# EAGLE design SolenoidController (EAGLE 9.4.1)
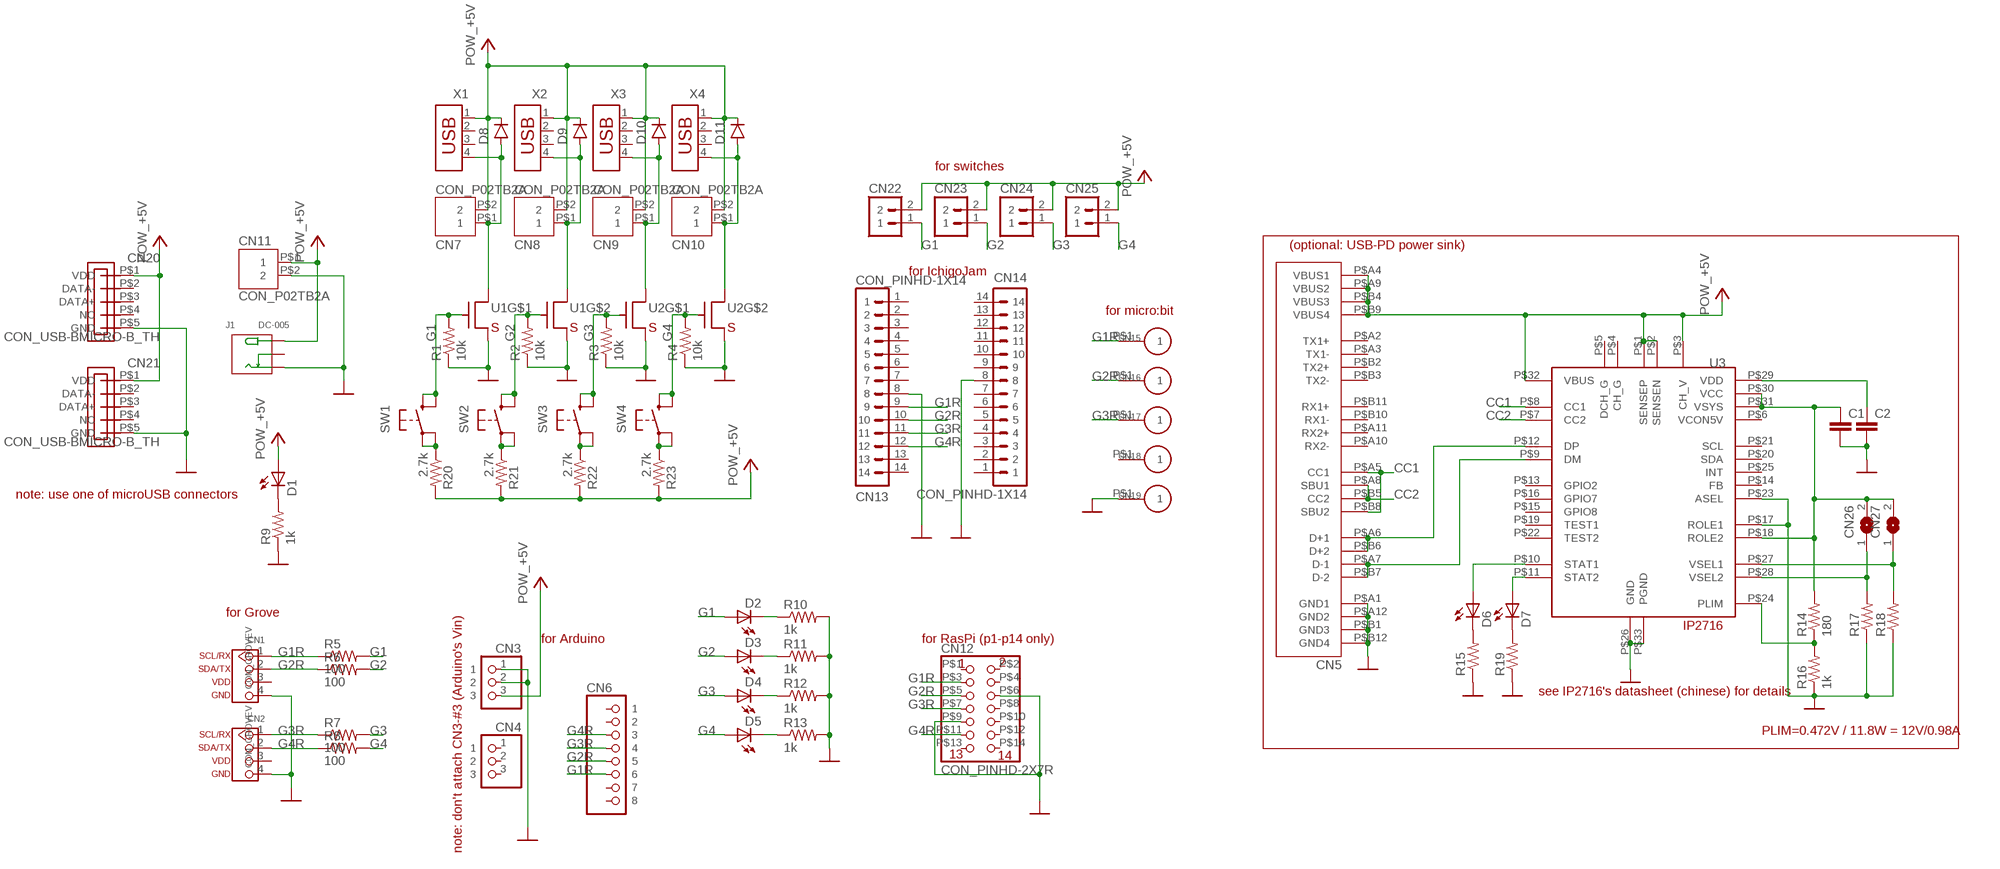
[diagram p0: schematic, sheet 1]

## Parts
C1  CAP0603  [0603]
C2  CAP0603  [0603]
CN1  CON_GROVEV  [CON_GROVE_V]
CN2  CON_GROVEV  [CON_GROVE_V]
CN3  CON_PINHD-1X3R  [1X03R]
CN4  CON_PINHD-1X3R  [1X03R]
CN5  CON_USB-C  [USB-C_24P]
CN6  CON_PINHD-1X8R  [1X08R]
CN7  CON_P02TB2A  [TERM_BLOCK_2P]
CN8  CON_P02TB2A  [TERM_BLOCK_2P]
CN9  CON_P02TB2A  [TERM_BLOCK_2P]
CN10  CON_P02TB2A  [TERM_BLOCK_2P]
CN11  CON_P02TB2A  [TERM_BLOCK_2P]
CN12  CON_PINHD-2X7R  [2X7R]
CN13  CON_PINHD-1X14  [1X14]
CN14  CON_PINHD-1X14  [1X14]
CN15  CON_P01TH04MM  [TH4MM]
CN16  CON_P01TH04MM  [TH4MM]
CN17  CON_P01TH04MM  [TH4MM]
CN18  CON_P01TH04MM  [TH4MM]
CN19  CON_P01TH04MM  [TH4MM]
CN20  CON_USB-BMICRO-B_TH  [USB-MICROB-TH]
CN21  CON_USB-BMICRO-B_TH  [USB-MICROB-TH]
CN22  CON_PINHD-1X2PTH  [SPARKFUN_1X02]
CN23  CON_PINHD-1X2PTH  [SPARKFUN_1X02]
CN24  CON_PINHD-1X2PTH  [SPARKFUN_1X02]
CN25  CON_PINHD-1X2PTH  [SPARKFUN_1X02]
CN26  JUMPER_SJ  [JUMPER_SJ]
CN27  JUMPER_SJ  [JUMPER_SJ]
D1  LED5MM  [SPARKFUN_LED5MM]
D2  LED5MM  [SPARKFUN_LED5MM]
D3  LED5MM  [SPARKFUN_LED5MM]
D4  LED5MM  [SPARKFUN_LED5MM]
D5  LED5MM  [SPARKFUN_LED5MM]
D6  LED0603  [SPARKFUN_LED-0603]
D7  LED0603  [SPARKFUN_LED-0603]
D8  DIODESOD123FL  [SOD123FL]
D9  DIODESOD123FL  [SOD123FL]
D10  DIODESOD123FL  [SOD123FL]
D11  DIODESOD123FL  [SOD123FL]
J1  DC-005  CONN-POWER-JACK-2.1MM(DC-005)  [DCJ3P-14.2X11.0X9.0MM]
R1  10k  RES0603  [0603]
R2  10k  RES0603  [0603]
R3  10k  RES0603  [0603]
R4  10k  RES0603  [0603]
R5  100  RES0603  [0603]
R6  100  RES0603  [0603]
R7  100  RES0603  [0603]
R8  100  RES0603  [0603]
R9  1k  RES0603  [0603]
R10  1k  RES0603  [0603]
R11  1k  RES0603  [0603]
R12  1k  RES0603  [0603]
R13  1k  RES0603  [0603]
R14  180  RES0603  [0603]
R15  RES0603  [0603]
R16  1k  RES0603  [0603]
R17  RES0603  [0603]
R18  RES0603  [0603]
R19  RES0603  [0603]
R20  2.7k  RES0603  [0603]
R21  2.7k  RES0603  [0603]
R22  2.7k  RES0603  [0603]
R23  2.7k  RES0603  [0603]
SW1  SW_TACTSMD_B3FS4  [SW_B3FS-4]
SW2  SW_TACTSMD_B3FS4  [SW_B3FS-4]
SW3  SW_TACTSMD_B3FS4  [SW_B3FS-4]
SW4  SW_TACTSMD_B3FS4  [SW_B3FS-4]
U1  TR_NMOS_IRF7103  [SO08]
U2  TR_NMOS_IRF7103  [SO08]
U3  PMU_IP2716  [QFN32E]
X1  CON_USB-A  [USB-A]
X2  CON_USB-A  [USB-A]
X3  CON_USB-A  [USB-A]
X4  CON_USB-A  [USB-A]

## Nets
+5V: CN3.3 CN5.P$A4(VBUS1) CN5.P$A9(VBUS2) CN5.P$B4(VBUS3) CN5.P$B9(VBUS4) CN7.P$2 CN8.P$2 CN9.P$2 CN10.P$2 CN11.P$1 CN20.P$1(VDD) CN21.P$1(VDD) CN22.2 CN23.2 CN24.2 CN25.2 D1.A D8.P$K D9.P$K D10.P$K D11.P$K J1.+ R20.2 R21.2 R22.2 R23.2 U3.P$1(SENSEP) U3.P$2(SENSEN) U3.P$3(CH_V) U3.P$32(VBUS) X1.1 X2.1 X3.1 X4.1 ; supply symbol labelled POW_+5V
CC1: CN5.P$A5(CC1) CN5.P$B8(SBU2) U3.P$8(CC1)
CC2: CN5.P$A8(SBU1) CN5.P$B5(CC2) U3.P$7(CC2)
G1: CN22.1 D2.A R1.2 R5.2 SW1.P$3(S) SW1.P$4(S1) U1.2(G)
G1R: CN1.1 CN6.6 CN12.P$3 CN13.9 CN15.P$1 R5.1
G2: CN23.1 D3.A R2.2 R6.2 SW2.P$3(S) SW2.P$4(S1) U1.4(G)
G2R: CN1.2 CN6.5 CN12.P$5 CN13.10 CN16.P$1 R6.1
G3: CN24.1 D4.A R3.2 R7.2 SW3.P$3(S) SW3.P$4(S1) U2.2(G)
G3R: CN2.1 CN6.4 CN12.P$7 CN13.11 CN17.P$1 R7.1
G4: CN25.1 D5.A R4.2 R8.2 SW4.P$3(S) SW4.P$4(S1) U2.4(G)
G4R: CN2.2 CN6.3 CN12.P$11 CN13.12 R8.1
GND: C1.2 C2.2 CN1.4 CN2.4 CN3.1 CN3.2 CN5.P$A1(GND1) CN5.P$A12(GND2) CN5.P$B1(GND3) CN5.P$B12(GND4) CN11.P$2 CN12.P$6 CN12.P$9 CN13.8 CN14.8 CN19.P$1 CN20.P$5(GND) CN21.P$5(GND) J1.-1(-) R1.1 R2.1 R3.1 R4.1 R9.1 R10.2 R11.2 R12.2 R13.2 R15.1 R16.1 R17.1 R18.1 R19.1 U1.1(S) U1.3(S) U2.1(S) U2.3(S) U3.P$17(ROLE1) U3.P$23(ASEL) U3.P$26(GND) U3.P$33(PGND) ; supply symbol labelled POW_GND
N$1: CN7.P$1 D8.P$A U1.7(D) X1.4
N$2: CN8.P$1 D9.P$A U1.5(D) X2.4
N$3: CN9.P$1 D10.P$A U2.7(D) X3.4
N$4: C2.1 U3.P$29(VDD)
N$5: D1.K(C) R9.2
N$6: D2.K(C) R10.1
N$7: R14.1 R16.2 U3.P$24(PLIM)
N$8: D3.K(C) R11.1
N$9: CN26.1 R17.2 U3.P$28(VSEL2)
N$10: D4.K(C) R12.1
N$11: R21.1 SW2.P$1(P) SW2.P$2(P1)
N$12: D5.K(C) R13.1
N$13: CN27.1 R18.2 U3.P$27(VSEL1)
N$14: C1.1 CN26.2 CN27.2 R14.2 U3.P$18(ROLE2) U3.P$30(VCC) U3.P$31(VSYS)
N$15: D6.C R15.2
N$16: CN10.P$1 D11.P$A U2.5(D) X4.4
N$17: D7.C R19.2
N$18: D7.A U3.P$11(STAT2)
N$19: D6.A U3.P$10(STAT1)
N$20: CN5.P$A6(D+1) CN5.P$B6(D+2) U3.P$12(DP)
N$21: R23.1 SW4.P$1(P) SW4.P$2(P1)
N$22: CN5.P$A7(D-1) CN5.P$B7(D-2) U3.P$9(DM)
N$23: R22.1 SW3.P$1(P) SW3.P$2(P1)
N$24: R20.1 SW1.P$1(P) SW1.P$2(P1)
Unconnected: CN1.3 CN2.3 CN4.1 CN4.2 CN4.3 CN5.P$A2(TX1+) CN5.P$A3(TX1-) CN5.P$A10(RX2-) CN5.P$A11(RX2+) CN5.P$B2(TX2+) CN5.P$B3(TX2-) CN5.P$B10(RX1-) CN5.P$B11(RX1+) CN6.1 CN6.2 CN6.7 CN6.8 CN12.P$1 CN12.P$2 CN12.P$4 CN12.P$8 CN12.P$10 CN12.P$12 CN12.P$13 CN12.P$14 CN13.1 CN13.2 CN13.3 CN13.4 CN13.5 CN13.6 CN13.7 CN13.13 CN13.14 CN14.1 CN14.2 CN14.3 CN14.4 CN14.5 CN14.6 CN14.7 CN14.9 CN14.10 CN14.11 CN14.12 CN14.13 CN14.14 CN18.P$1 CN20.P$2(DATA-) CN20.P$3(DATA+) CN20.P$4(NC) CN21.P$2(DATA-) CN21.P$3(DATA+) CN21.P$4(NC) J1.-2(CDN) U3.P$4(CH_G) U3.P$5(DCH_G) U3.P$6(VCON5V) U3.P$13(GPIO2) U3.P$14(FB) U3.P$15(GPIO8) U3.P$16(GPIO7) U3.P$19(TEST1) U3.P$20(SDA) U3.P$21(SCL) U3.P$22(TEST2) U3.P$25(INT) X1.2 X1.3 X2.2 X2.3 X3.2 X3.3 X4.2 X4.3

## Notes on the sheet
- for switches
- (optional: USB-PD power sink)
- for IchigoJam
- for micro:bit
- note: use one of microUSB connectors
- for Grove
- IP2716
- for Arduino | for RasPi (p1-p14 only)
- see IP2716's datasheet (chinese) for details
- PLIM=0.472V / 11.8W = 12V/0.98A
- note: don't attach CN3-#3 (Arduino's Vin)

## Library data of the parts
C1 C2 = akita:CAP: Capacitor Standard 0603 ceramic capacitor, and 0.1" leaded capacitor.
CN1 CN2 = akita:CON_GROVE: Seeed Grove
CN3 CN4 = akita:CON_PINHD-1X3: PIN HEADER
CN5 = akita:CON_USB-C: USB Type-C, Receptable
CN6 = akita:CON_PINHD-1X8: PIN HEADER
CN7-CN11 = akita:CON_P02: general 2p connector
CN12 = akita:CON_PINHD-2X7
CN13 CN14 = akita:CON_PINHD-1X14
CN15-CN19 = akita:CON_P01
CN20 CN21 = akita:CON_USB-B
CN22-CN25 = akita:CON_PINHD-1X2: Header 2 Standard 2-pin 0.1" header. Use with straight break away headers (SKU : PRT-00116), right angle break away headers (PRT-00553), swiss pins (PRT-00743), machine pins (PRT-00117), and female headers (PRT-00115). Molex polarized connector foot print use with SKU : PRT-08233 with associated crimp pins and housings.
CN26 CN27 = akita:JUMPER_SJ: SMD solder JUMPER
D1-D7 = akita:LED: LEDs Standard schematic elements and footprints for 5mm, 3mm, 1206, and 0603 sized LEDs. 5mm - Spark Fun Electronics SKU : COM-00529 (and others)
D8-D11 = akita:DIODE: Diode
J1 = Seeed-Connector:CONN-POWER-JACK-2.1MM(DC-005): 320120003; MPN: DC-005
R1-R23 = akita:RES: Resistor Basic schematic elements and footprints for 0603, 1206, and PTH resistors.
SW1-SW4 = akita:SW_TACT: OMRON SWITCH
U1 U2 = akita:TR_NMOS_IRF7103: Dual nMOS, SOP8, IOR IRF7103, Fairchild NDS9936
U3 = akita:PMU_IP2716: Injoinic, USB-C PD, DFP/UFP
X1-X4 = akita:CON_USB-A: AMP connector

## Board
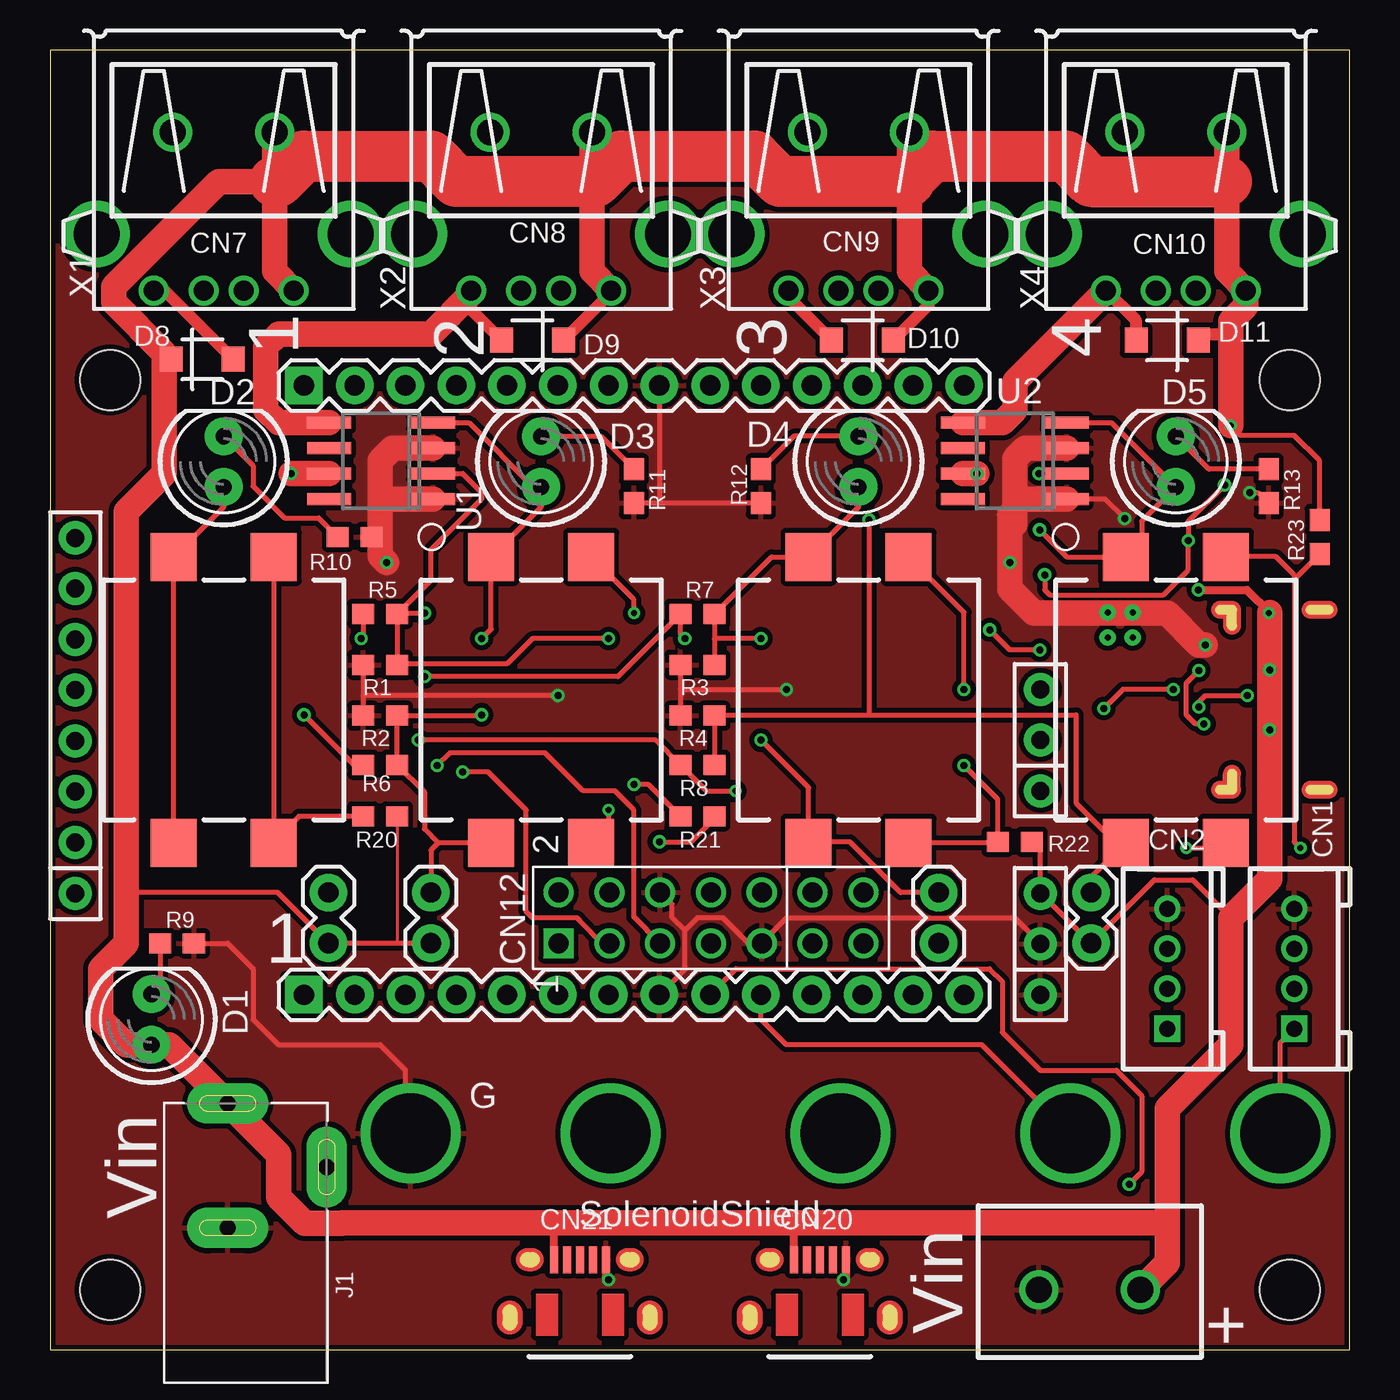
[diagram p1: board, top side]
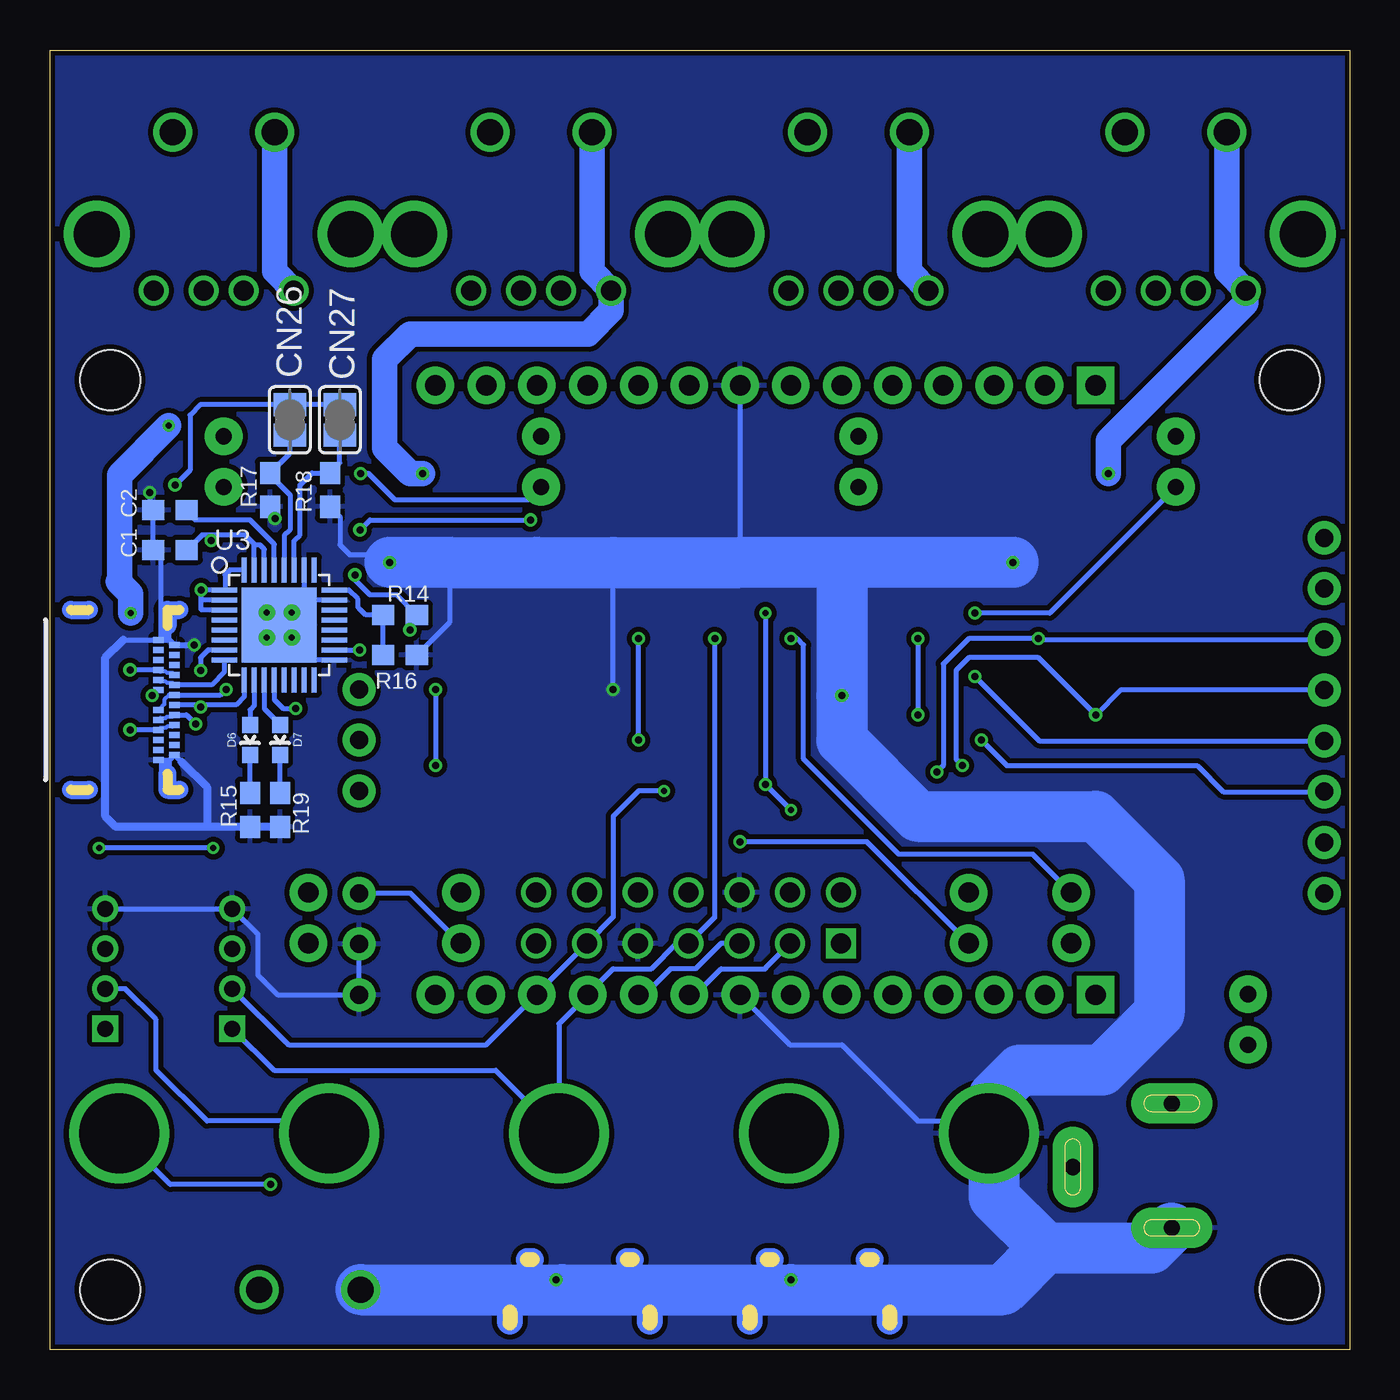
[diagram p2: board, bottom side, seen from below]

Size 65 x 65 mm. Coordinates in mm from the lower left corner, seen from the top.
Outline: 0,0 65,0 65,65 0,65 0,0
Copper layers (1*16): Top 0.035mm / dielectric 1.5mm / Bottom 0.035mm
Design rules "SeeedStudio_2layer_DRU_no_angle_20140221": minimum track width 6mil, minimum drill 12mil, track to track 6mil, track to pad 6mil, pad to pad 6mil, via to via 6mil, smd to smd 0mil, copper to edge 10mil, drill to drill 10mil, minimum pad ring 10mil, minimum via ring 6mil, stop-mask expansion 2mil, vias tented up to drill 100mil, thermal gap 10mil
Holes 3 mm at 3,48.5 3,3 62,48.5 62,3

### Footprints (pad centres in the part's own frame; a part is rotated, then mirrored left to right if it is on the bottom)
0603 = smd 1.1 x 1: 1 -0.85,0; 2 0.85,0
CON_GROVE_V = drill 0.8 pad 1.27 square: 1 -3,0 | drill 0.8 pad 1.27: 2 -1,0; 3 1,0; 4 3,0
1X03R = drill 0.9 pad 1.651: 1 -2.54,0; 2 0,0; 3 2.54,0
USB-C_24P = smd 0.3 x 0.53: P$A1 -2.75,2.73; P$A2 -2.25,2.73; P$A3 -1.75,2.73; P$A4 -1.25,2.73; P$A5 -0.75,2.73; P$A6 -0.25,2.73; P$A7 0.25,2.73; P$A8 0.75,2.73; P$A9 1.25,2.73; P$A10 1.75,2.73; P$A11 2.25,2.73; P$A12 2.75,2.73; P$B1 3,1.93; P$B2 2.5,1.93; P$B3 2,1.93; P$B4 1.5,1.93; P$B5 1,1.93; P$B6 0.5,1.93; P$B7 -0.5,1.93; P$B8 -1,1.93; P$B9 -1.5,1.93; P$B10 -2,1.93; P$B11 -2.5,1.93; P$B12 -3,1.93
1X08R = drill 0.9 pad 1.651: 1 -8.89,0; 2 -6.35,0; 3 -3.81,0; 4 -1.27,0; 5 1.27,0; 6 3.81,0; 7 6.35,0; 8 8.89,0
TERM_BLOCK_2P = drill 1.3: P$1 2.54,0; P$2 -2.54,0
2X7R = drill 1 square: P$1 -7.62,-1.27 | drill 1: P$2 -7.62,1.27; P$3 -5.08,-1.27; P$4 -5.08,1.27; P$5 -2.54,-1.27; P$6 -2.54,1.27; P$7 0,-1.27; P$8 0,1.27; P$9 2.54,-1.27; P$10 2.54,1.27; P$11 5.08,-1.27; P$12 5.08,1.27; P$13 7.62,-1.27; P$14 7.62,1.27
1X14 = drill 1.016 pad 1.88 square: 1 -16.51,0 | drill 1.016 pad 1.88: 2 -13.97,0; 3 -11.43,0; 4 -8.89,0; 5 -6.35,0; 6 -3.81,0; 7 -1.27,0; 8 1.27,0; 9 3.81,0; 10 6.35,0; 11 8.89,0; 12 11.43,0; 13 13.97,0; 14 16.51,0
TH4MM = drill 4: P$1 0,0
USB-MICROB-TH = smd 0.4 x 1.35: P$1 -1.3,1.5; P$2 -0.65,1.5; P$3 0,1.5; P$4 0.65,1.5; P$5 1.3,1.5
SPARKFUN_1X02 = drill 1.016 pad 1.88: 1 0,0; 2 2.54,0
JUMPER_SJ = smd 1.168 x 1.6: 1 -0.762,0; 2 0.762,0
SPARKFUN_LED5MM = drill 0.813 pad 1.88: A -1.27,0; K 1.27,0
SPARKFUN_LED-0603 = smd 0.8 x 0.8: A 0,-0.75; C 0,0.75
SOD123FL = smd 1.15 x 1.25: P$A -1.55,0; P$K 1.55,0
DCJ3P-14.2X11.0X9.0MM = drill 0.813 pad 2.032 long: + 3.175,0; -1 -3.048,0; -2 0,-4.953
SW_B3FS-4 = smd 2.4 x 2.3: P$1 7.15,-2.5; P$2 -7.15,-2.5; P$3 7.15,2.5; P$4 -7.15,2.5
SO08 = smd 0.6 x 2.2: 1 -1.905,-2.6; 2 -0.635,-2.6; 3 0.635,-2.6; 4 1.905,-2.6; 5 1.905,2.6; 6 0.635,2.6; 7 -0.635,2.6; 8 -1.905,2.6
QFN32E = smd 1.27 x 0.25: P$1 -2.75,1.75; P$2 -2.75,1.25; P$3 -2.75,0.75; P$4 -2.75,0.25; P$5 -2.75,-0.25; P$6 -2.75,-0.75; P$7 -2.75,-1.25; P$8 -2.75,-1.75; P$17 2.75,-1.75; P$18 2.75,-1.25; P$19 2.75,-0.75; P$20 2.75,-0.25; P$21 2.75,0.25; P$22 2.75,0.75; P$23 2.75,1.25; P$24 2.75,1.75 | smd 0.25 x 1.27: P$9 -1.75,-2.75; P$10 -1.25,-2.75; P$11 -0.75,-2.75; P$12 -0.25,-2.75; P$13 0.25,-2.75; P$14 0.75,-2.75; P$15 1.25,-2.75; P$16 1.75,-2.75; P$25 1.75,2.75; P$26 1.25,2.75; P$27 0.75,2.75; P$28 0.25,2.75; P$29 -0.25,2.75; P$30 -0.75,2.75; P$31 -1.25,2.75; P$32 -1.75,2.75 | smd 3.75 x 3.75: P$33 0,0 | drill 0.3 pad 0.6: P$34 -0.625,0.625; P$35 0.625,0.625; P$36 0.625,-0.625; P$37 -0.625,-0.625
USB-A = drill 1: 1 -3.5,12.99; 2 -1,12.99; 3 1,12.99; 4 3.5,12.99 | drill 2.3: P$G1 -6.35,10.16; P$G2 6.35,10.16

### Placement (x,y rotation side)
C1  59,40 180 bottom
C2  59,42 180 bottom
CN1  62.23,19.05 90 top
CN2  55.88,19.05 90 top
CN3  49.53,20.28 90 top
CN4  49.53,30.48 90 top
CN5  61.5,32.5 270 bottom
CN6  1.27,31.71 90 top
CN7  8.69,60.88 180 top
CN8  24.56,60.88 180 top
CN9  40.44,60.88 180 top
CN10  56.31,60.88 180 top
CN11  52,3 0 top
CN12  33.06,21.59 0 top
CN13  29.21,17.74 0 top
CN14  29.21,48.22 0 top
CN15  61.54,10.81 0 top
CN16  51.04,10.81 0 top
CN17  39.54,10.81 0 top
CN18  28.04,10.81 0 top
CN19  18.04,10.81 0 top
CN20  38.5,3 0 top
CN21  26.5,3 0 top
CN22  13.93,22.86 270 top
CN23  19.05,22.86 270 top
CN24  44.45,22.86 270 top
CN25  52.07,22.86 270 top
CN26  53,46.5 90 bottom
CN27  50.5,46.5 90 bottom
D1  5.08,16.51 90 top
D2  8.69,44.41 90 top
D3  24.56,44.41 90 top
D4  40.44,44.41 90 top
D5  56.31,44.41 90 top
D6  55,30.5 180 bottom
D7  53.5,30.5 180 bottom
D8  7.62,49.53 180 top
D9  24.13,50.48 0 top
D10  40.64,50.48 0 top
D11  55.88,50.48 0 top
J1  8.89,9.13 90 top
R1  16.51,34.25 0 top
R2  16.51,31.71 0 top
R3  32.38,34.25 0 top
R4  32.38,31.71 0 top
R5  16.51,36.79 0 top
R6  16.51,29.25 0 top
R7  32.38,36.79 0 top
R8  32.38,29.25 0 top
R9  6.35,20.32 180 top
R10  15.24,40.64 0 top
R11  29.21,43.18 270 top
R12  35.56,43.18 270 top
R13  60.96,43.18 270 top
R14  47.5,36.75 0 bottom
R15  55,27 90 bottom
R16  47.5,34.75 180 bottom
R17  54,43 90 bottom
R18  51,43 90 bottom
R19  53.5,27 90 bottom
R20  16.51,26.67 0 top
R21  32.38,26.67 0 top
R22  48.26,25.4 0 top
R23  63.5,40.64 90 top
SW1  8.69,32.5 90 top
SW2  24.56,32.5 90 top
SW3  40.44,32.5 90 top
SW4  56.31,32.5 90 top
U1  16.55,44.45 90 top
U2  48.26,44.45 90 top
U3  53.53,36.24 0 bottom
X1  8.69,65.96 180 top
X2  24.56,65.96 180 top
X3  40.44,65.96 180 top
X4  56.31,65.96 180 top

### Tracks (layer width: path | path; a pad name or v marks a point on that pad's centre or on a via)
+5V  (via drill 0.3, 0.35)
  Top 0.152: 17.46,20.32 17.36,20.42 R20.2
  Top 0.254: CN23.2 17.46,20.32 CN22.2 11.39,22.86 3.81,22.86 | R22.2 49.51,25 49.51,22.84 CN3.3 49.57,22.82 CN25.2 55.24,23.5 57.15,23.5 59.05,21.59 | v30.48,25.4 32.07,25.4 33.23,26.57 R21.2 | R23.2 63.5,44.45 62.23,45.72 59.55,45.72 v59.05,46.22
  Top 0.406: CN21.P$1 25.2,6.15 25.4,6.35 | CN20.P$1 37.2,5.98 36.83,6.35 | v57.43,38 59.87,38 61,36.87
  Top 0.61: D11.P$K 57.75,50.8 59.05,50.8 | D10.P$K 43.94,52.23 X3.1 | D9.P$K 28.06,52.87 X2.1 | D8.P$K 6.03,49.53 5.71,49.85
  Top 1.27: CN7.P$2 11.23,58.42 | 11.23,58.42 11.23,53.93 X1.1 | CN8.P$2 27.1,58.42 27.1,53.93 X2.1 | CN9.P$2 42.98,58.42 42.98,53.93 X3.1 | CN10.P$2 58.85,58.42 58.85,53.93 X4.1 59.81,52.19 59.05,51.44 59.05,50.8 v59.05,46.22 | 11.23,58.42 8.44,58.42 3.17,53.16 3.17,52.39 5.71,49.85 5.71,43.81 3.81,41.91 3.81,22.86 3.81,20.32 2.54,19.05 2.54,16.51 3.81,15.24 D1.A 5.96,15.24 J1.+ 11.43,9.77 11.43,7.62 12.74,6.31 14.59,6.31 14.63,6.35 25.4,6.35 36.83,6.35 55.88,6.35 | CN11.P$1 55.88,4.34 55.88,6.35 | 55.88,6.35 55.88,12.06 59.05,15.24 59.05,21.59 61,23.54 v61,31 v61,34 61,36.87
  Top 2.54: 11.23,58.42 11.43,58.42 12.7,59.69 19.05,59.69 20.32,58.42 27.1,58.42 27.3,58.42 28.57,59.69 35.24,59.69 36.51,58.42 42.86,58.42 | 42.86,58.42 44.13,59.69 50.8,59.69 52.07,58.42 58.85,58.42 | 42.98,58.42 42.86,58.42
  Bottom 0.2: CN5.P$A4 58.87,33.85 59.15,33.85 59.2,33.9 59.47,33.9 CN5.P$B9 | CN5.P$A9 58.87,31.15 59.15,31.15 59.2,31.1 59.47,31.1 CN5.P$B4
  Bottom 0.254: CN5.P$B9 v61,34 | CN5.P$B4 v61,31 | U3.P$3 57.43,37 v57.43,38 | v57.43,38 57.43,37.49 U3.P$2 | v57.43,38 v57.43,37.99 U3.P$1 56.25,38.02 56.25,38.75 56,39 55.99,38.99 U3.P$32 | CN24.2 46.95,22.82 CN3.3 | CN23.2 24.13,25.4 v30.48,25.4
  Bottom 1.27: v59.05,46.22 61.52,43.74 61.52,38.49 61.59,38.42 60.96,37.78 v60.96,36.83
CC1
  Bottom 0.2: CN5.P$A5 58.87,33.35 59.15,33.35 59.2,33.4 59.47,33.4 CN5.P$B8
  Bottom 0.254: U3.P$8 56.28,33.89 56.92,33.25 CN5.P$A5
CC2  (via drill 0.35)
  Top 0.254: v57.72,31.3 57.28,31.3 56.83,31.75 56.83,33.34 v57.47,33.97
  Bottom 0.2: CN5.P$B5 59.47,31.6 59.19,31.6 59.14,31.65 58.87,31.65 CN5.P$A8
  Bottom 0.254: CN5.P$A8 58.17,31.75 v57.72,31.3 | U3.P$7 57.09,34.99 57.47,34.61 v57.47,33.97
G1  (via drill 0.35)
  Top 0.254: U1.2 20.64,43.81 21.59,42.86 21.59,42.55 19.05,40.01 19.05,38.48 R5.2 | R5.2 17.36,34.29 | 17.36,34.29 R1.2 | v27.94,35.56 24.13,35.56 22.86,34.29 17.36,34.29 | D2.A 8.69,42.15 SW1.P$3 SW1.P$4 | R5.2 17.4,36.83 v18.73,36.83
  Bottom 0.254: CN22.1 15.84,24.77 22.54,24.77 27.3,29.53 27.3,35.24 27.62,35.56 v27.94,35.56 | D2.A 15,36.83 v18.73,36.83
G1R  (via drill 0.35)
  Top 0.254: R5.1 15.66,35.66 v15.56,35.56 | CN15.P$1 61.54,15.36 CN1.1 | CN13.9 34.29,19.01 34.29,19.05 46.99,19.05 47.62,18.41 47.62,15.88 49.53,13.97 53.34,13.97 54.61,12.7 54.61,8.89 v53.98,8.26 | CN12.P$3 27.62,20.32 26.51,21.43 26.35,21.59 24.13,21.59 23.81,21.91 23.81,26.99 21.91,28.89 v20.64,28.89
  Bottom 0.254: CN6.6 15.52,35.52 v15.56,35.56 19.05,35.56 20.32,34.29 20.32,29.21 v20.64,28.89 | CN12.P$3 29.21,19.09 29.21,19.05 31.43,19.05 32.74,17.74 CN13.9 | v53.98,8.26 58.98,8.26 CN15.P$1
G2  (via drill 0.35)
  Top 0.254: U1.4 20.95,46.35 24.17,43.14 D3.A 24.56,42.15 SW2.P$3 22.06,36.03 v21.59,35.56 | R2.2 17.78,31.71 | 17.78,31.71 17.36,31.29 R6.2 18.73,27.88 18.73,26.03 19.41,25.35 | CN23.1 19.05,24.99 19.41,25.35 | 17.78,31.71 21.55,31.71 v21.59,31.75 | SW2.P$4 19.41,25.35
  Bottom 0.254: v21.59,35.56 v21.59,31.75
G2R  (via drill 0.35)
  Top 0.254: v12.7,31.75 15.24,29.21 15.62,29.21 R6.1 | CN16.P$1 46.61,15.24 36.83,15.24 35.56,16.51 CN13.10 | v19.37,29.21 20,29.84 24.77,29.84 26.67,27.94 28.26,27.94 29.21,26.99 29.21,21.63 CN12.P$5
  Bottom 0.254: CN6.5 11.47,32.98 v12.7,31.75 15.56,34.61 19.05,34.61 19.68,33.97 19.68,29.53 v19.37,29.21 | CN16.P$1 51.66,11.43 57.15,11.43 59.69,13.97 59.69,16.51 61.23,18.05 CN1.2 | CN12.P$5 31.43,20.32 32.7,19.05 33.97,19.05 34.92,18.1 34.92,17.78 34.97,17.74 CN13.10
G3  (via drill 0.35)
  Top 0.254: 33.23,35.56 R7.2 36.09,39.65 SW3.P$3 40.44,42.15 D4.A | 33.23,35.56 R3.2 | v35.56,35.56 33.23,35.56 | SW3.P$4 37.94,25.4 | 37.94,25.4 37.94,28.1 v35.56,30.48 | CN24.1 42.55,22.86 40.01,25.4 37.94,25.4
  Top 0.61: v49.45,43.81 U2.2
  Bottom 0.254: v35.56,30.48 v35.56,35.56 | D4.A 41.08,42.5 47.75,42.5 49.06,43.81 v49.45,43.81
G3R  (via drill 0.35)
  Top 0.254: v18.73,33.66 28.4,33.66 R7.1 31.54,35.77 v31.75,35.56
  Bottom 0.254: CN6.4 15.52,30.44 v18.73,33.66 | CN2.1 53.8,13.97 42.7,13.97 CN17.P$1 39.54,16.3 CN13.11 38.1,17.78 36.83,19.05 34.92,19.05 33.66,20.32 CN12.P$7 31.79,21.59 31.75,21.59 v31.75,35.56
G4  (via drill 0.35)
  Top 0.254: R8.2 R4.2 33.27,31.75 40.96,31.75 | U2.4 53.1,46.35 D5.A 54.61,41.44 54.61,39.37 54.09,39.37 SW4.P$3 50.85,39.65 v49.5,41 | 40.96,31.75 51.31,31.75 51.31,27.35 53.52,25.14 SW4.P$4 52.07,23.61 CN25.1 | v40.96,41.5 40.96,31.75
  Bottom 0.254: v49.5,41 49,41.5 v40.96,41.5
G4R  (via drill 0.3, 0.35)
  Top 0.254: v18.41,30.48 30.3,30.48 R8.1 32.84,27.94 v34.29,27.94
  Bottom 0.254: 40.64,17.78 CN13.12 | CN2.2 53.07,15.24 43.18,15.24 40.64,17.78 | 40.64,17.78 40.64,17.82 CN12.P$11 36.83,21.63 36.83,26.67 35.56,27.94 v34.29,27.94 | v18.41,30.48 17.14,29.21 7.62,29.21 6.31,27.9 CN6.3
GND  (via drill 0.35)  (1 unrouted)
  Top 0.254: R1.1 15.66,32.7 | 15.66,32.7 R2.1 | R3.1 31.54,33.02 | 31.54,33.02 R4.1 | 48.01,41.27 48.26,41.27 | v25.4,32.7 15.66,32.7 | CN13.8 31.75,19.01 31.75,20.95 | 31.75,20.95 31.11,21.59 31.11,22.27 CN12.P$6 | 31.75,20.95 32.38,21.59 33.66,21.59 34.92,20.32 CN12.P$9 35.6,20.36 36.83,21.59 48.26,21.59 49.53,20.32 CN3.2 | R9.1 8.89,20.32 10.16,19.05 10.16,16.51 11.43,15.24 16.51,15.24 17.78,13.97 17.78,11.07 CN19.P$1 | 55.46,37.29 55,36.83 | 53.75,37.08 54,36.83 | 48.26,42.55 47.47,41.75 | R10.2 16.51,40.64 | 31.54,33.02 v36.83,33.02 | R12.2 30.48,42.33 | 30.48,42.33 R11.2 | CN14.8 30.48,42.33 | v53.75,41.57 52.77,42.55 U2.1 | v60.01,42.86 60.43,42.86 R13.2
  Top 0.406: CN21.P$5 27.8,3.63 v27.94,3.49 | CN20.P$5 39.8,3.6 v39.69,3.49
  Top 1.27: U1.3 17.14,45.09 16.51,44.45 16.51,42.55 | U1.1 16.51,42.55 | U2.3 48.78,45.09 48.26,44.56 48.26,42.55 | 48.26,42.55 48.26,41.27 | 48.01,41.77 48.01,41.27 v48.01,39.37 48.01,38.03 49.21,36.83 54,36.83 55,36.83 55.88,36.83 57.47,35.24 v57.78,35.24 | U2.1 48.26,42.55 | v16.83,39.37 16.51,39.69 16.51,40.64 16.51,42.55
  Bottom 0.254: CN14.8 30.48,39.37 | CN13.8 27.98,15.24 25.4,15.24 21.59,11.43 18.66,11.43 CN19.P$1 18.04,12.44 17.78,12.7 | CN1.4 CN2.4 54.61,20.78 54.61,18.73 53.62,17.74 CN3.1 CN3.2 49.53,20.32 | CN12.P$9 35.6,20.36 | CN5.P$A1 59.02,35.5 CN5.P$B12 59.69,35.5 | CN5.P$B1 59.02,29.5 CN5.P$A12 58.42,29.4 | U3.P$17 51.99,34.49 53.53,36.03 U3.P$33 | R16.1 45,36.4 45,39.37 | C2.2 59.85,41.91 | 59.85,41.91 C1.2 59.47,39.62 59.47,35.5 61.34,35.5 | U3.P$26 52.28,38 | 52.28,38 52.28,37.28 52,37 53.17,37 53.34,36.83 53.34,36.43 U3.P$33 | U3.P$23 51.77,37.49 52.28,38 | R17.1 54,41.75 53.75,41.5 v53.75,41.57 | 53.64,36.36 54,36.71 54,36.83 | 54,36.83 54,37 | v48.01,39.37 48.39,39.75 50,39.75 50.5,40.25 50.5,41.65 R18.1 | U3.P$33 53.53,36.47 | 53.53,36.52 53.53,36.47 | 53.53,36.47 53.64,36.36 | U3.P$33 53.64,36.36 | U3.P$33 53.53,36.36 54,36.83 | 41.27,38.73 40.64,39.37 | v36.83,33.02 36.83,39.37 | v60.01,42.86 60.01,42.07 59.85,41.91
  Bottom 0.305: CN5.P$A1 57.79,35.25
  Bottom 0.406: v27.94,3.49 27.94,3 | v39.69,3.49 39.69,3.32 39.37,3 | R19.1 R15.1 57.15,26.15 | 57.15,26.15 61.71,26.15 62.23,26.67 62.23,34.61 61.34,35.5 | 58.42,29.4 57.15,28.13 57.15,26.15 | 57.79,35.25 v57.78,35.24
  Bottom 2.54: v16.83,39.37 25.4,39.37 | 25.4,39.37 30.48,39.37 36.83,39.37 40.64,39.37 45,39.37 v48.01,39.37 | 25.4,39.37 v25.4,32.7 25.4,30.48 21.59,26.67 12.7,26.67 9.53,23.5 9.53,16.83 12.38,13.97 16.51,13.97 17.78,12.7 17.78,7.62 15.24,5.08 | 15.24,5.08 9.89,5.08 J1.-1 | 15.24,5.08 17.32,3 27.94,3 39.37,3 CN11.P$2
  pour Top (isolate 0.254): 0,65 65,65 65,0 0,0
  pour Bottom (isolate 0.254): 0,65 65,65 65,0 0,0
N$1  (via drill 0.35)
  Top 0.61: D8.P$A 5.73,52.97 X1.4
  Top 1.27: v12.06,43.81 U1.7
  Bottom 1.27: CN7.P$1 6.15,53.93 X1.4 5.19,52.34 12.06,45.46 v12.06,43.81
N$2
  Top 0.61: D9.P$A 21.06,52 X2.4
  Top 1.27: X2.4 21.06,52.81 19.05,50.8 11.43,50.8 10.79,50.16 10.79,46.99 11.43,46.35 U1.5
  Bottom 1.27: CN8.P$1 22.02,53.93 X2.4
N$3  (via drill 0.35)
  Top 0.61: D10.P$A 36.94,52.63 X3.4
  Top 1.27: v46.35,43.81 U2.7
  Bottom 1.27: CN9.P$1 37.9,53.93 X3.4 36.94,51.96 38.1,50.8 46.99,50.8 48.26,49.53 48.26,45.09 46.99,43.81 v46.35,43.81
N$4
  Bottom 0.254: U3.P$29 53.78,40.28 55,41.5 57.75,41.5 57.75,41.6 C2.1
N$5
  Top 0.254: R9.2 5.5,18.2 D1.K
N$6
  Top 0.254: D2.K 10.16,44.21 10.16,43.18 11.75,41.59 13.44,41.59 R10.1
N$7
  Bottom 0.254: R16.2 R14.1 49.2,36.75 49.45,37 49.6,37.15 49.6,37.53 50.05,37.99 U3.P$24
N$8
  Top 0.254: D3.K 27.56,45.68 R11.1
N$9
  Bottom 0.254: CN26.1 53,44.85 R17.2 54.05,43.8 53,42.75 53,41 53.28,40.72 U3.P$28
N$10
  Top 0.254: D4.K 37.21,45.68 R12.1
N$11  (via drill 0.3, 0.35)
  Top 0.254: SW2.P$2 27.89,25.35 27.94,25.4 v27.94,26.99 | R21.1 29.95,28.26 v29.21,28.26 | v29.21,36.83 29.21,37.5 SW2.P$1
  Bottom 0.254: v27.94,26.99 v29.21,28.26 v29.21,36.83
N$12
  Top 0.254: R13.1 57.96,44.03 D5.K
N$13
  Bottom 0.254: U3.P$27 52.78,40.47 52.5,40.75 52.5,43.25 51.9,43.85 R18.2 50.51,44.34 50.51,45.74 CN27.1
N$14  (via drill 0.35)
  Top 0.254: v49.51,34.99 v49.5,35 48,35 v47,36 | v49.75,38.75 49.75,38 50,37.75 55.68,37.75 56.93,39 v56.93,40.45 56.93,41.43 v58.75,43.25
  Bottom 0.254: 46.7,36.8 R14.2 46.75,36.75 | 46.7,36.8 47.65,37.75 49,37.75 49.75,38.5 v49.75,38.75 | U3.P$18 v49.51,34.99 | v47,36 47,36.5 46.75,36.75 | 46.75,36.75 46.7,36.8 | CN27.2 CN26.2 57.49,47.26 58,46.75 58,44 v58.75,43.25 | U3.P$30 54.28,40.03 54.5,40.25 54.75,40.25 54.78,40.22 | U3.P$31 54.78,40.22 | 54.78,40.22 54.78,40.28 55.25,40.75 57.15,40.75 | C1.1 57.4,40.75 57.15,40.75 | v56.93,40.45 56.93,40.53 57.15,40.75
N$15
  Bottom 0.254: R15.2 D6.C
N$16
  Top 0.61: D11.P$A 54.33,51.45 X4.4
  Top 1.27: X4.4 48.26,48.42 48.26,46.99 47.62,46.35 U2.5
  Bottom 1.27: CN10.P$1 53.77,53.93 X4.4
N$17
  Bottom 0.254: R19.2 D7.C
N$18
  Bottom 0.254: U3.P$11 54.28,32.05 53.5,31.27 D7.A
N$19
  Bottom 0.254: U3.P$10 54.78,32.22 55,32 D6.A
N$20  (via drill 0.35)
  Top 0.254: v56.2,33.02 53.66,33.02 v52.7,32.07
  Bottom 0.2: CN5.P$B6 59.29,32.28 59.29,32.51 59.04,32.75 CN5.P$A6
  Bottom 0.254: CN5.P$A6 56.47,32.75 v56.2,33.02 | U3.P$12 53.78,32.51 53.34,32.07 v52.7,32.07
N$21  (via drill 0.3)
  Top 0.254: 62.23,38.52 62.23,38.73 61.31,39.65 SW4.P$1 | R23.1 62.23,38.52 | v62.55,25.08 62.23,25.4 62.23,38.52 | v56.83,25.08 58.55,25.08 SW4.P$2
  Bottom 0.254: v56.83,25.08 v62.55,25.08
N$22  (via drill 0.35)
  Top 0.254: v59.88,32.7 57.78,32.7 57.47,32.38 v57.47,32.14
  Bottom 0.254: 57.47,32.25 CN5.P$A7 | U3.P$9 55.28,32.67 55.7,32.25 57.15,32.25 57.47,32.25 | CN5.P$B7 59.71,33 60.01,32.7 v59.88,32.7 | v57.47,32.14 57.47,32.25
N$23  (via drill 0.35)
  Top 0.254: SW3.P$2 47.36,25.35 R22.1 47.41,27.52 v45.72,29.21 | v45.72,33.02 45.72,36.87 SW3.P$1
  Bottom 0.254: v45.72,33.02 v45.72,29.21
N$24
  Top 0.254: SW1.P$1 11.19,25.4 | 11.19,25.4 SW1.P$2 | R20.1 12.46,26.67 11.19,25.4
(copper drawn outside any net)
  shapes: Bottom area x2

### Text on the board
tPlace: 1 | 2 | 3 | 4 | 1 | G | Vin | SolenoidShield | Vin | +